# Altium schematic sheet WT2_Sensors.SchDoc
size A4
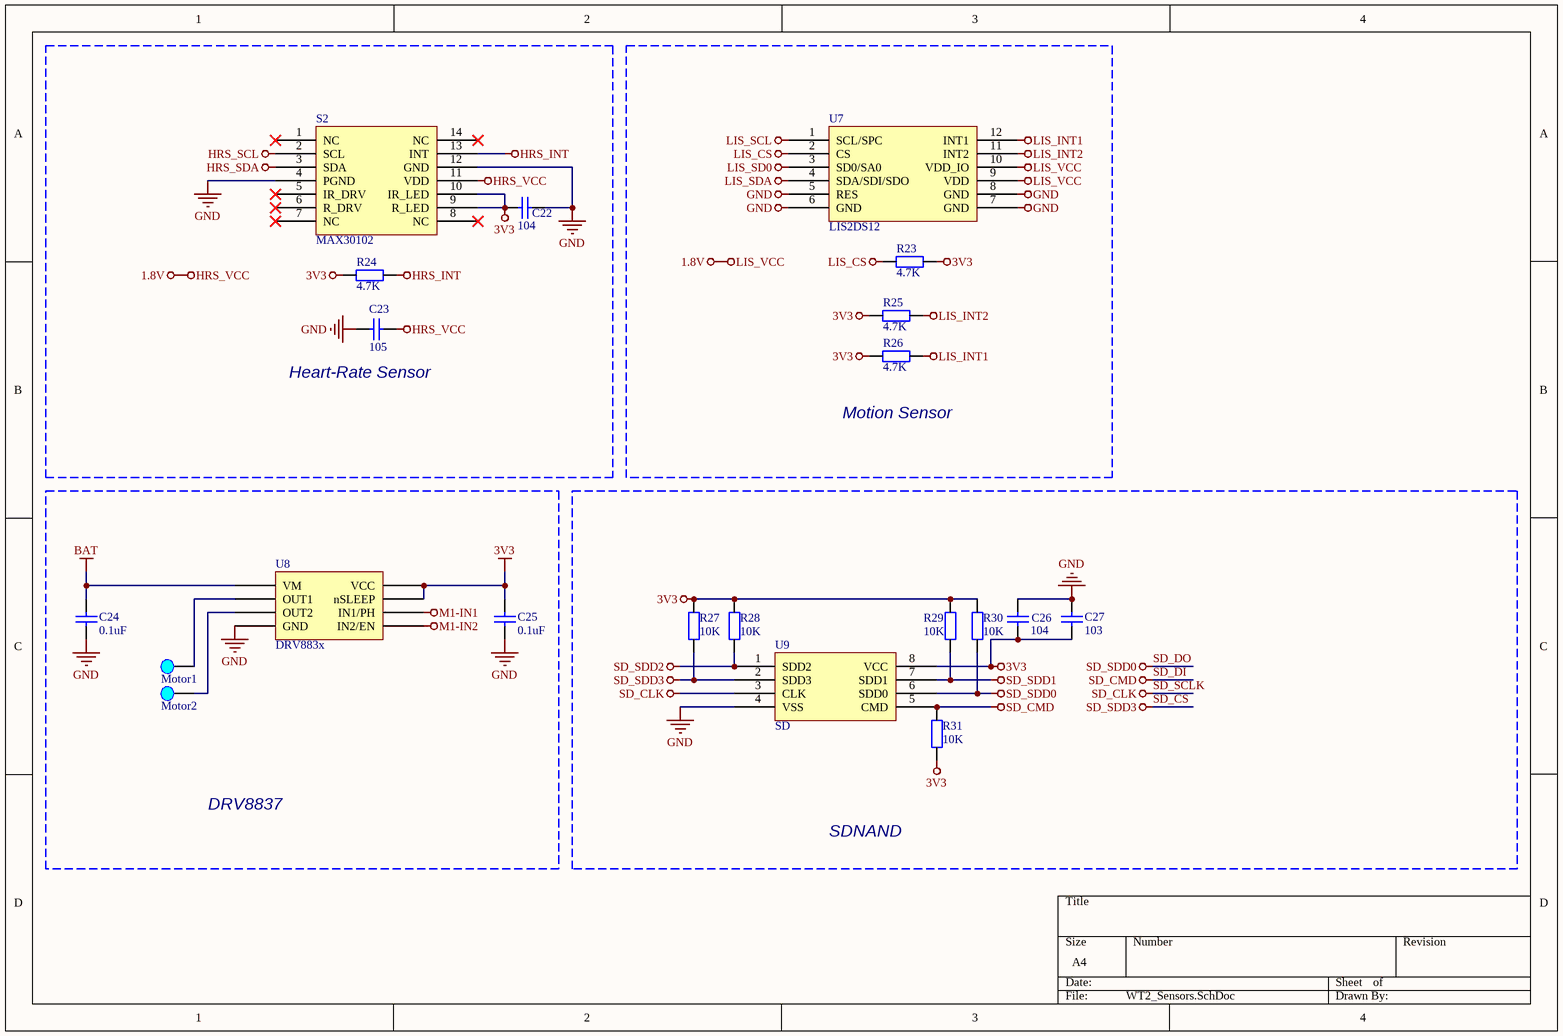
[diagram p0: WT2_Sensors.SchDoc]

## Parts
C22  104  [电容_C0402]
C23  105  [电容_C0402]
C24  0.1uF  [电容_C0402]
C25  0.1uF  [电容_C0402]
C26  104  [电容_C0402]
C27  103  [电容_C0402]
Pad3  Motor1  [Pad_A]
Pad4  Motor2  [Pad_A]
R23  4.7K  [电阻_R0402]
R24  4.7K  [电阻_R0402]
R25  4.7K  [电阻_R0402]
R26  4.7K  [电阻_R0402]
R27  10K  [电阻_R0402]
R28  10K  [电阻_R0402]
R29  10K  [电阻_R0402]
R30  10K  [电阻_R0402]
R31  10K  [电阻_R0402]
S2  MAX30102  [MAX30102]
U7  LIS2DS12  [LGA-12_2*2mm]
U8  DRV883x  [WSON-8_2*2]
U9  SD  [LGA-8_6*8mm2]

## Blocks framed on the sheet
Heart-Rate Sensor: C22 C23 R24 S2
Motion Sensor: R23 R25 R26 U7
DRV8837: C24 C25 Pad3 Pad4 U8
SDNAND: C26 C27 R27-R31 U9

## Nets
1.8V: C23.1 S2.11(VDD) U7.9(VDD) U7.10(VDD_IO)  [also labelled HRS_VCC, LIS_VCC]
3V3: C22.2 C25.2 C26.1 C27.1 R23.1 R24.2 R25.2 R26.2 R27.1 R28.1 R29.1 R30.1 R31.2 S2.9(R_LED) S2.10(IR_LED) U8.7(nSLEEP) U8.8(VCC) U9.8(VCC)
BAT: C24.1 U8.1(VM)
GND: C22.1 C23.2 C24.2 C25.1 C26.2 C27.2 S2.4(PGND) S2.12(GND) U7.5(RES) U7.6(GND) U7.7(GND) U7.8(GND) U8.4(GND) U9.4(VSS)
HRS_INT: R24.1 S2.13(INT)
HRS_SCL: S2.2(SCL)
HRS_SDA: S2.3(SDA)
LIS_CS: R23.2 U7.2(CS)
LIS_INT1: R26.1 U7.12(INT1)
LIS_INT2: R25.1 U7.11(INT2)
LIS_SCL: U7.1(SCL/SPC)
LIS_SD0: U7.3(SD0/SA0)
LIS_SDA: U7.4(SDA/SDI/SDO)
M1-IN1: U8.6(IN1/PH)
M1-IN2: U8.5(IN2/EN)
SD_CS: R27.2 U9.2(SDD3)  [also labelled SD_SDD3]
SD_DI: R31.1 U9.5(CMD)  [also labelled SD_CMD]
SD_DO: R30.2 U9.6(SDD0)  [also labelled SD_SDD0]
SD_SCLK: U9.3(CLK)  [also labelled SD_CLK]
SD_SDD1: R29.2 U9.7(SDD1)
SD_SDD2: R28.2 U9.1(SDD2)
NetPad3_1: Pad3.1 U8.2(OUT1)
NetPad4_1: Pad4.1 U8.3(OUT2)

Not connected (* = marked no-connect by the designer): S2 1(NC)* 5(IR_DRV)* 6(R_DRV)* 7(NC)* 8(NC)* 14(NC)*

## Library data of the parts
C22-C27 = cap: U: 50V; 参数: Cap,0805,X7R,104K,50V,125C,±10%
  C22 C26: C: 104
  C23: C: 105
  C24 C25: C: 0.1uF
  C27: C: 103
Pad3 = Pad: _Funcyusa: Test; _Specification: Pad,Test,Motor1; _Comma: ,; _Name: Pad; _Remarks: Motor1
Pad4 = Pad: _Funcyusa: Test; _Specification: Pad,Test,Motor2; _Comma: ,; _Name: Pad; _Remarks: Motor2
R23-R31 = Res: P: 1/8W; 参数: Res,0805,0R,±1%,1/8W,100ppm,155C
  R23-R26: R: 4.7K
  R27-R31: R: 10K
S2 = MAX30102: 血氧浓度传感器
U7 = LIS2DS12: 运动传感器
U9 = SDNAND